# Altium project AD_Project.PrjPcb
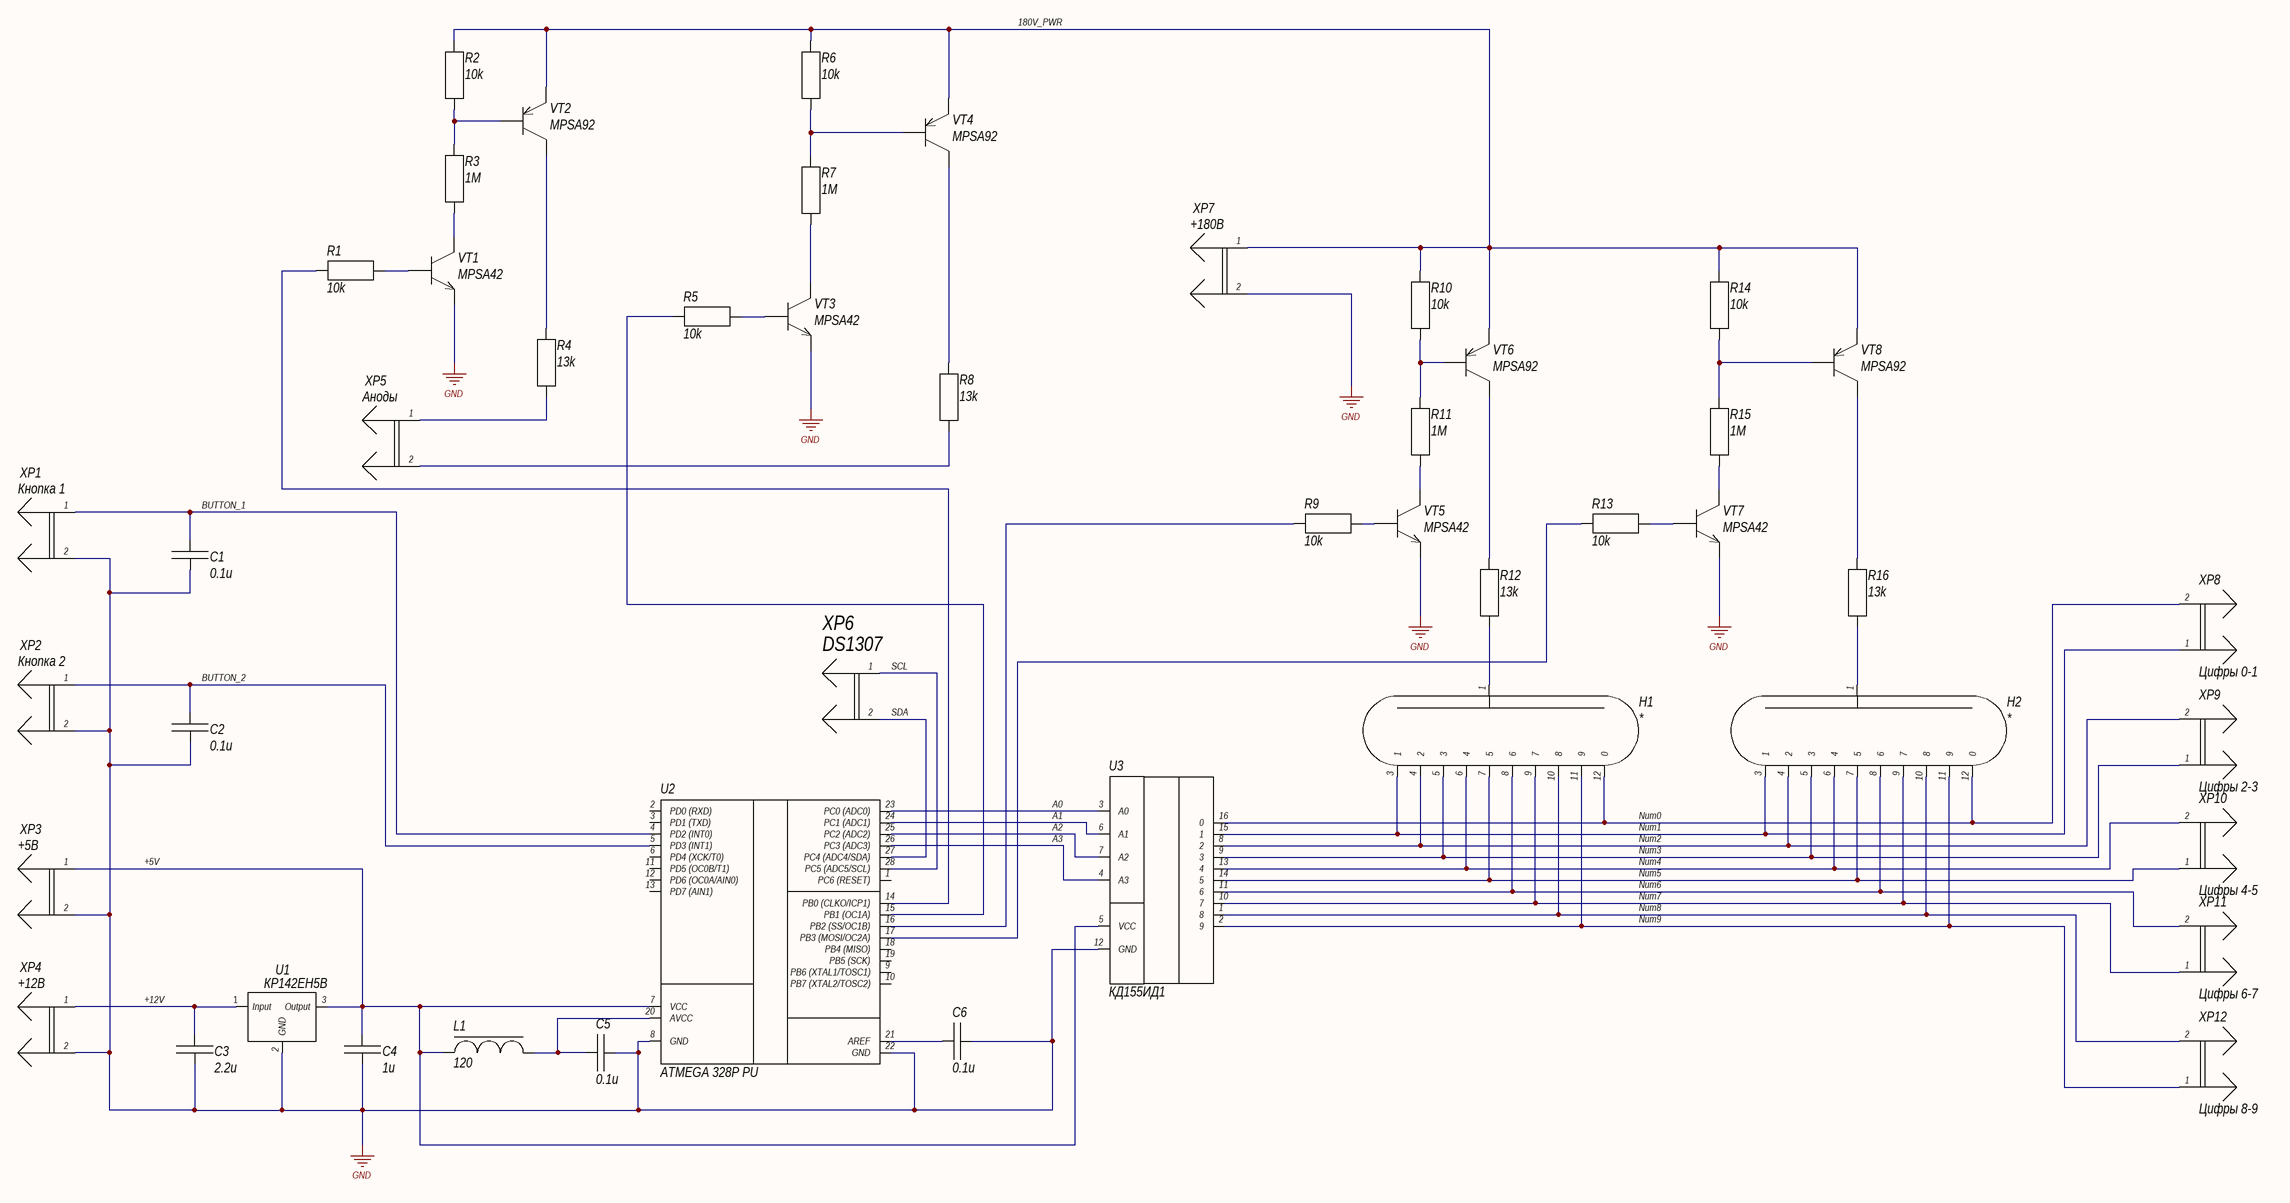
[diagram p0: NIXIE.SchDoc]
1 sheet, 48 parts. Net scope: global (net labels, ports and power ports of the same name join across sheets).
Board file: FOR_JLCPCB.PcbDoc

## Sheet NIXIE.SchDoc
size 594 x 420 mm; Address1: Address1; Address2: Address2; Address3: Address3; Address4: Address4; DocumentNumber: АБВГ.123456.001 Э3; SheetNumber: 1; Scale: 1:1; DocumentType: Схема электрическая принципиальная; FirstReferrence: АБВГ.123456.001

### Parts
C1  0.1u  [C_AXIAL_K10-17]
C2  0.1u  [C_AXIAL_K10-17]
C3  2.2u  [C1206]
C4  1u  [C0805]
C5  0.1u  [C_AXIAL_K10-17]
C6  0.1u  [C_AXIAL_K10-17]
H1  *  [IN-14]
H2  *  [IN-14]
L1  120  [INDUCTOR_AXIAL]
R1  10k  [R1206]
R2  10k  [R1206]
R3  1M  [R1206]
R4  13k  [R1206]
R5  10k  [R1206]
R6  10k  [R1206]
R7  1M  [R1206]
R8  13k  [R1206]
R9  10k  [R1206]
R10  10k  [R1206]
R11  1M  [R1206]
R12  13k  [R1206]
R13  10k  [R1206]
R14  10k  [R1206]
R15  1M  [R1206]
R16  13k  [R1206]
U1  КР142ЕН5В  [TO-220_HORIZONTAL]
U2  ATMEGA 328P PU  [DIP28]
U3  КД155ИД1  [DIP16]
VT1  MPSA42  [TO-92]
VT2  MPSA92  [TO-92]
VT3  MPSA42  [TO-92]
VT4  MPSA92  [TO-92]
VT5  MPSA42  [TO-92]
VT6  MPSA92  [TO-92]
VT7  MPSA42  [TO-92]
VT8  MPSA92  [TO-92]
XP1  Кнопка 1  [2_PIN_INPUT]
XP2  Кнопка 2  [2_PIN_INPUT]
XP3  +5В  [2_PIN_INPUT]
XP4  +12В  [2_PIN_INPUT]
XP5  Аноды  [2_PIN_INPUT]
XP6  DS1307  [2_PIN_INPUT]
XP7  +180В  [2_PIN_INPUT]
XP8  Цифры 0-1  [2_PIN_INPUT]
XP9  Цифры 2-3  [2_PIN_INPUT]
XP10  Цифры 4-5  [2_PIN_INPUT]
XP11  Цифры 6-7  [2_PIN_INPUT]
XP12  Цифры 8-9  [2_PIN_INPUT]

### Nets
GND: C1.1 C2.1 C3.1 C4.1 C5.2 C6.2 U1.2(GND) U2.8(GND) U2.22(GND) U3.12(GND) VT1.1(Э) VT3.1(Э) VT5.1(Э) VT7.1(Э) XP1.2 XP2.2 XP3.2 XP4.2 XP7.2
180V_PWR: R2.2 R6.2 R10.2 R14.2 VT2.1(Э) VT4.1(Э) VT6.1(Э) VT8.1(Э) XP7.1
+5V: C4.2 L1.1 U1.3(Output) U2.7(VCC) U3.5(VCC) XP3.1
+12V: C3.2 U1.1(Input) XP4.1
A0: U2.23(PC0_(ADC0)) U3.3(A0)
A1: U2.24(PC1_(ADC1)) U3.6(A1)
A2: U2.25(PC2_(ADC2)) U3.7(A2)
A3: U2.26(PC3_(ADC3)) U3.4(A3)
BUTTON_1: C1.2 U2.4(PD2_(INT0)) XP1.1
BUTTON_2: C2.2 U2.5(PD3_(INT1)) XP2.1
Num0: H1.12(0) H2.12(0) U3.16(0) XP8.2
Num1: H1.3(1) H2.3(1) U3.15(1) XP8.1
Num2: H1.4(2) H2.4(2) U3.8(2) XP9.2
Num3: H1.5(3) H2.5(3) U3.9(3) XP9.1
Num4: H1.6(4) H2.6(4) U3.13(4) XP10.2
Num5: H1.7(5) H2.7(5) U3.14(5) XP10.1
Num6: H1.8(6) H2.8(6) U3.11(6) XP11.2
Num7: H1.9(7) H2.9(7) U3.10(7) XP11.1
Num8: H1.10(8) H2.10(8) U3.1(8) XP12.2
Num9: H1.11(9) H2.11(9) U3.2(9) XP12.1
SCL: U2.28(PC5_(ADC5/SCL)) XP6.1
SDA: U2.27(PC4_(ADC4/SDA)) XP6.2
NetC5_1: C5.1 L1.2 U2.20(AVCC)
NetC6_1: C6.1 U2.21(AREF)
NetH1_1: H1.1(А) R12.1
NetH2_1: H2.1(А) R16.1
NetR1_1: R1.1 U2.14(PB0_(CLKO/ICP1))
NetR1_2: R1.2 VT1.2(Б)
NetR2_1: R2.1 R3.2 VT2.2(Б)
NetR3_1: R3.1 VT1.3(К)
NetR4_1: R4.1 XP5.1
NetR4_2: R4.2 VT2.3(К)
NetR5_1: R5.1 U2.15(PB1_(OC1A))
NetR5_2: R5.2 VT3.2(Б)
NetR6_1: R6.1 R7.2 VT4.2(Б)
NetR7_1: R7.1 VT3.3(К)
NetR8_1: R8.1 XP5.2
NetR8_2: R8.2 VT4.3(К)
NetR9_1: R9.1 U2.16(PB2_(SS/OC1B))
NetR9_2: R9.2 VT5.2(Б)
NetR10_1: R10.1 R11.2 VT6.2(Б)
NetR11_1: R11.1 VT5.3(К)
NetR12_2: R12.2 VT6.3(К)
NetR13_1: R13.1 U2.17(PB3_(MOSI/OC2A))
NetR13_2: R13.2 VT7.2(Б)
NetR14_1: R14.1 R15.2 VT8.2(Б)
NetR15_1: R15.1 VT7.3(К)
NetR16_2: R16.2 VT8.3(К)

Not connected (* = marked no-connect by the designer): U2 1(PC6_(RESET)) 2(PD0_(RXD)) 3(PD1_(TXD)) 6(PD4_(XCK/T0)) 9(PB6_(XTAL1/TOSC1)) 10(PB7_(XTAL2/TOSC2)) 11(PD5_(OC0B/T1)) 12(PD6_(OC0A/AIN0)) 13(PD7_(AIN1)) 18(PB4_(MISO)) 19(PB5_(SCK))

### Library data of the parts
C1-C6 = CAPACITOR: MODEL: *; MANUFATURER: *; CASE: *
  C1 C2: VALUE: 0.1u
  C3: VALUE: 2.2u; URL: *
  C4: VALUE: 1u; URL: https://www.chipdip.ru/product/grm21br71c105k
  C5 C6: VALUE: 0.1u; URL: *
H1 H2 = IN-14: MODEL: *
L1 = INDUCTOR: VALUE: 120
R1-R16 = RESISTOR: MODEL: *; MANUFACTURER: *; CASE: 1206
  R1 R2 R5 R6 R9 R10 R13 R14: URL: https://www.chipdip.ru/product0/9000079659; VALUE: 10k
  R3 R7 R11 R15: URL: https://www.chipdip.ru/product0/690816980; VALUE: 1M
  R4 R8 R12 R16: URL: https://www.chipdip.ru/product0/9000079662; VALUE: 13k
U1 = VOLTAGE_REGULATOR: MODEL: КР142ЕН5В; MANUFACTURER: *; URL: *; CASE: *
U2 = ATMEGA_328P_PU: MANUFACTURER: *; MODEL: ATMEGA 328P PU; URL: *
U3 = K155ID1: MODEL: КД155ИД1; URL: *
VT1 VT3 VT5 VT7 = TRANSISTOR_BJT_NPN: MODEL: MPSA42; URL: *
VT2 VT4 VT6 VT8 = TRANSISTOR_BJT_PNP: MODEL: MPSA92; URL: *
XP1-XP12 = Con-2-M: Value: Connector; Type: Вилка
  XP1-XP5 XP7-XP12: Published: 07.03.2013; Publisher: Andrew Danich
  XP6: URL: https://www.chipdip.ru/product/pls-40